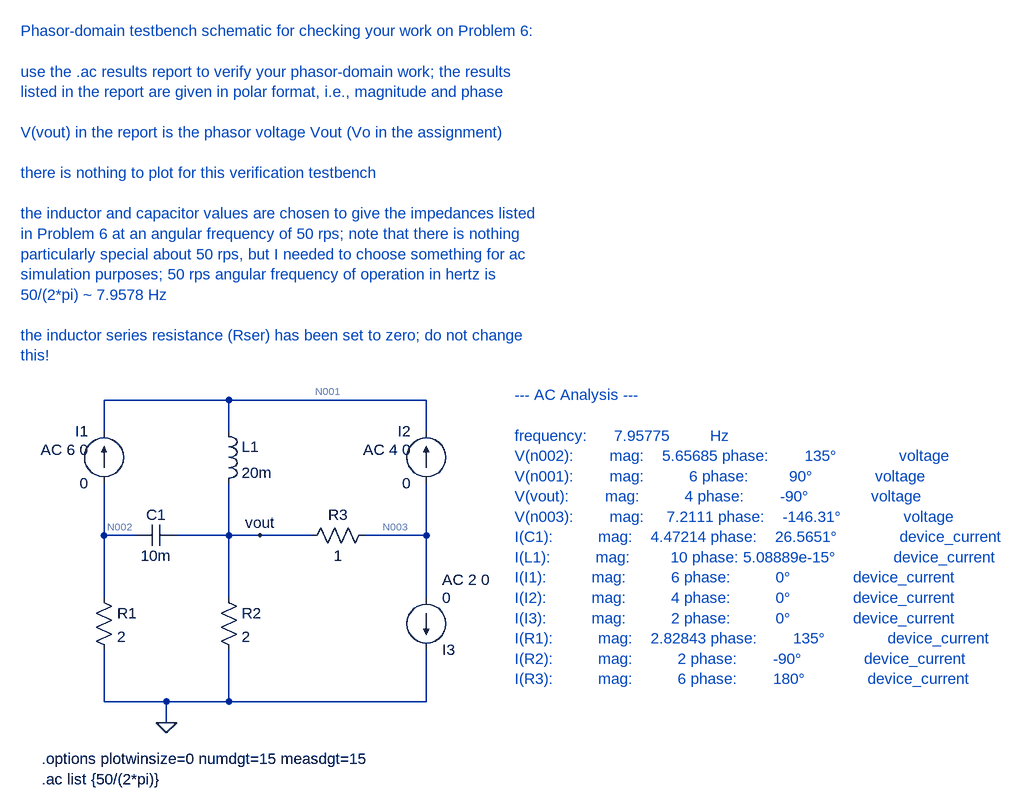
[diagram p0: schematic hw7_prob6.asc]
hw7_prob6.asc, the LTspice schematic file:
Version 4
SHEET 1 984 964
WIRE -272 -64 -464 -64
WIRE 32 -64 -272 -64
WIRE -464 -16 -464 -64
WIRE -272 -16 -272 -64
WIRE 32 -16 32 -64
WIRE -464 144 -464 64
WIRE -416 144 -464 144
WIRE -272 144 -272 64
WIRE -272 144 -352 144
WIRE -224 144 -272 144
WIRE -144 144 -224 144
WIRE 32 144 32 64
WIRE 32 144 -64 144
WIRE -464 240 -464 144
WIRE -272 240 -272 144
WIRE 32 240 32 144
WIRE -464 400 -464 320
WIRE -368 400 -464 400
WIRE -272 400 -272 320
WIRE -272 400 -368 400
WIRE 32 400 32 320
WIRE 32 400 -272 400
WIRE -368 432 -368 400
FLAG -368 432 0
FLAG -224 144 vout
SYMBOL res -480 224 R0
SYMATTR InstName R1
SYMATTR Value 2
SYMBOL ind -288 -32 R0
SYMATTR InstName L1
SYMATTR Value 20m
SYMATTR SpiceLine Rser=0
SYMBOL cap -352 128 R90
WINDOW 0 0 32 VBottom 2
WINDOW 3 32 32 VTop 2
SYMATTR InstName C1
SYMATTR Value 10m
SYMBOL res -288 224 R0
SYMATTR InstName R2
SYMATTR Value 2
SYMBOL res -48 128 R90
WINDOW 0 0 56 VBottom 2
WINDOW 3 32 56 VTop 2
SYMATTR InstName R3
SYMATTR Value 1
SYMBOL current -464 64 R180
WINDOW 0 24 80 Left 2
WINDOW 3 24 0 Left 2
WINDOW 123 24 52 Left 2
SYMATTR InstName I1
SYMATTR Value 0
SYMATTR Value2 AC 6 0
SYMBOL current 32 64 R180
WINDOW 0 24 80 Left 2
WINDOW 3 24 0 Left 2
WINDOW 123 24 52 Left 2
SYMATTR InstName I2
SYMATTR Value 0
SYMATTR Value2 AC 4 0
SYMBOL current 32 240 R0
WINDOW 0 24 80 Left 2
WINDOW 3 24 0 Left 2
WINDOW 123 24 -28 Left 2
SYMATTR InstName I3
SYMATTR Value 0
SYMATTR Value2 AC 2 0
TEXT -560 488 Left 2 !.options plotwinsize=0 numdgt=15 measdgt=15\n.ac list {50/(2*pi)}
TEXT -592 -632 Left 2 ;Phasor-domain testbench schematic for checking your work on Problem 6:\n \nuse the .ac results report to verify your phasor-domain work; the results\nlisted in the report are given in polar format, i.e., magnitude and phase\n \nV(vout) in the report is the phasor voltage Vout (Vo in the assignment)\n \nthere is nothing to plot for this verification testbench\n \nthe inductor and capacitor values are chosen to give the impedances listed\nin Problem 6 at an angular frequency of 50 rps; note that there is nothing \nparticularly special about 50 rps, but I needed to choose something for ac \nsimulation purposes; 50 rps angular frequency of operation in hertz is\n50/(2*pi) ~ 7.9578 Hz\n \nthe inductor series resistance (Rser) has been set to zero; do not change \nthis!
TEXT 168 -72 Left 2 ;--- AC Analysis ---\n \nfrequency:      7.95775         Hz\nV(n002):        mag:    5.65685 phase:        135°              voltage\nV(n001):        mag:          6 phase:         90°              voltage\nV(vout):        mag:          4 phase:        -90°              voltage\nV(n003):        mag:     7.2111 phase:    -146.31°              voltage\nI(C1):          mag:    4.47214 phase:    26.5651°              device_current\nI(L1):          mag:         10 phase: 5.08889e-15°             device_current\nI(I1):          mag:          6 phase:          0°              device_current\nI(I2):          mag:          4 phase:          0°              device_current\nI(I3):          mag:          2 phase:          0°              device_current\nI(R1):          mag:    2.82843 phase:        135°              device_current\nI(R2):          mag:          2 phase:        -90°              device_current\nI(R3):          mag:          6 phase:        180°              device_current

The netlist it stands for:
* hw7_prob6.asc
R1 N002 0 2
L1 N001 vout 20m Rser=0
C1 vout N002 10m
R2 vout 0 2
R3 N003 vout 1
I1 N002 N001 0 AC 6 0
I2 N003 N001 0 AC 4 0
I3 N003 0 0 AC 2 0
.options plotwinsize=0 numdgt=15 measdgt=15
.ac list {50/(2*pi)}
* Phasor-domain testbench schematic for checking your work on Problem 6:
* use the .ac results report to verify your phasor-domain work; the results
* listed in the report are given in polar format, i.e., magnitude and phase
* V(vout) in the report is the phasor voltage Vout (Vo in the assignment)
* there is nothing to plot for this verification testbench
* the inductor and capacitor values are chosen to give the impedances listed
* in Problem 6 at an angular frequency of 50 rps; note that there is nothing
* particularly special about 50 rps, but I needed to choose something for ac
* simulation purposes; 50 rps angular frequency of operation in hertz is
* 50/(2*pi) ~ 7.9578 Hz
* the inductor series resistance (Rser) has been set to zero; do not change
* this!
* --- AC Analysis ---
* frequency:      7.95775         Hz
* V(n002):        mag:    5.65685 phase:        135°              voltage
* V(n001):        mag:          6 phase:         90°              voltage
* V(vout):        mag:          4 phase:        -90°              voltage
* V(n003):        mag:     7.2111 phase:    -146.31°              voltage
* I(C1):          mag:    4.47214 phase:    26.5651°              device_current
* I(L1):          mag:         10 phase: 5.08889e-15°             device_current
* I(I1):          mag:          6 phase:          0°              device_current
* I(I2):          mag:          4 phase:          0°              device_current
* I(I3):          mag:          2 phase:          0°              device_current
* I(R1):          mag:    2.82843 phase:        135°              device_current
* I(R2):          mag:          2 phase:        -90°              device_current
* I(R3):          mag:          6 phase:        180°              device_current
.backanno
.end

* Results of the author's LTspice run, read from the files saved beside the schematic
* AC Analysis:
*   frequency = 7.958 
*   V(n002) = -4 V
*   V(n001) = -2.22 fV
*   V(vout) = -1.421 fV
*   V(n003) = -6 V
*   I(C1) = 4 A
*   I(L1) = 10 A
*   I(I1) = 6 A
*   I(I2) = 4 A
*   I(I3) = 2 A
*   I(R1) = -2 A
*   I(R2) = 0 A
*   I(R3) = -6 A